# Altium schematic sheet Microcontroller.SchDoc
size A3; ApprovedBy: OLD SCHOOL; CheckedBy: UDEMY; Revision: AA; SheetNumber: 4; SheetTotal: 5; Department: R&D Hardware; Size: A3; RreparedBy: M.Mesih ÇELİK; ReleaseDate: 06.10.2021; ChangedDate: 12.10.2021; BoardDescription: Wireless Security Detector
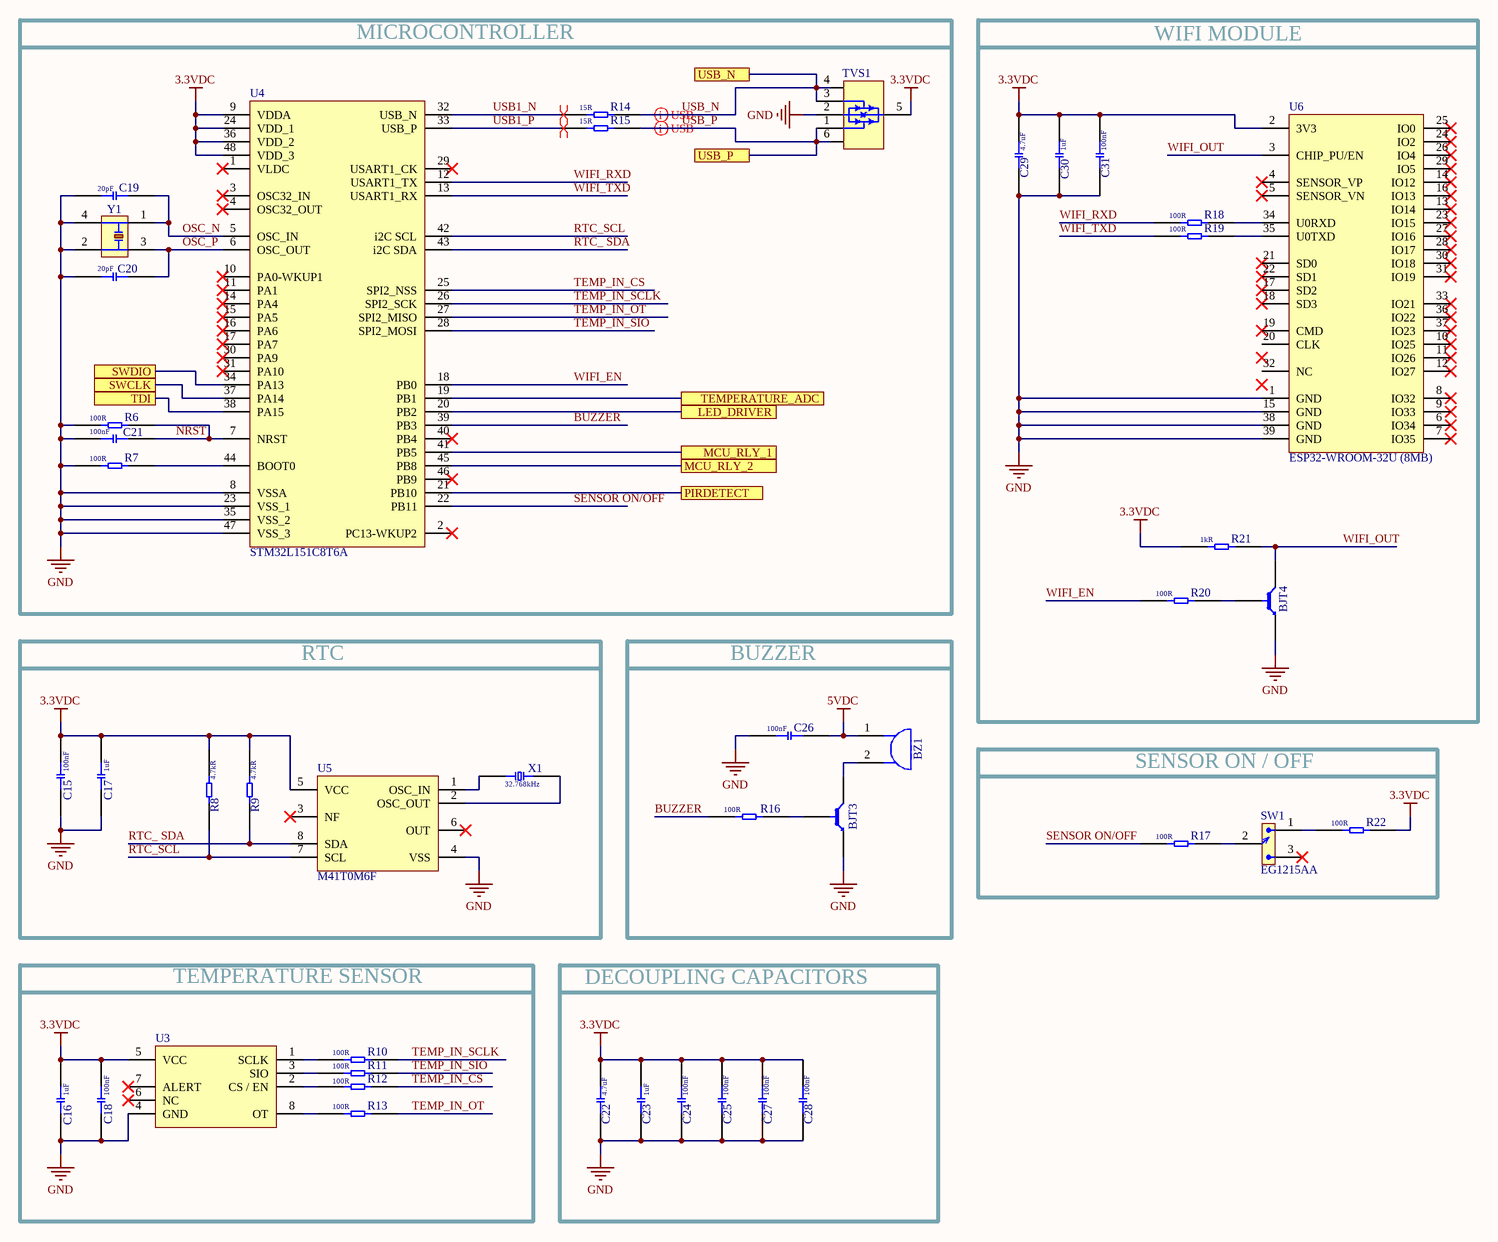
[diagram p0: Microcontroller.SchDoc]

## Parts
BJT3  MMBT3904-7-F  [SOT-23F]  (value not drawn)
BJT4  MMBT3904-7-F  [SOT-23F]  (value not drawn)
BZ1  CMI-1295IC-0585T  [CMI-1295IC]  (value not drawn)
C15  Capacitance: 100nF  [CAP_0603]  (hidden comment: C0603C104K5RACTU)
C16  Capacitance: 1uF  [CAP_0805]  (hidden comment: CL21B105KBFNNNE)
C17  Capacitance: 1uF  [CAP_0805]  (hidden comment: CL21B105KBFNNNE)
C18  Capacitance: 100nF  [CAP_0805]  (hidden comment: CL21B104KBCNNNC)
C19  Capacitance: 20pF  [CAP_0603]  (hidden comment: CL10C200JB8NNNC)
C20  Capacitance: 20pF  [CAP_0603]  (hidden comment: CL10C200JB8NNNC)
C21  Capacitance: 100nF  [CAP_0805]  (hidden comment: CL21B104KBCNNNC)
C22  Capacitance: 4.7uF  [CAP_0805]  (hidden comment: CL21A475KAQNNNE)
C23  Capacitance: 1uF  [CAP_0805]  (hidden comment: CL21B105KBFNNNE)
C24  Capacitance: 100nF  [CAP_0805]  (hidden comment: CL21B104KBCNNNC)
C25  Capacitance: 100nF  [CAP_0805]  (hidden comment: CL21B104KBCNNNC)
C26  Capaticante: 100nF  [CAP_0603]  (hidden comment: ALA7DF471CF450)
C27  Capacitance: 100nF  [CAP_0805]  (hidden comment: CL21B104KBCNNNC)
C28  Capacitance: 100nF  [CAP_0805]  (hidden comment: CL21B104KBCNNNC)
C29  Capacitance: 4.7uF  [CAP_0805]  (hidden comment: CL21A475KAQNNNE)
C30  Capacitance: 1uF  [CAP_0805]  (hidden comment: CL21B105KBFNNNE)
C31  Capacitance: 100nF  [CAP_0805]  (hidden comment: CL21B104KBCNNNC)
R6  Resistance: 100R  [RES_0603]  (hidden comment: RC0603JR-07100RL)
R7  Resistance: 100R  [RES_0603]  (hidden comment: RC0603JR-07100RL)
R8  Resistance: 4.7kR  [RES_0603]  (hidden comment: RC0603JR-074K7L)
R9  Resistance: 4.7kR  [RES_0603]  (hidden comment: RC0603JR-074K7L)
R10  Resistance: 100R  [RES_0603]  (hidden comment: RC0603JR-07100RL)
R11  Resistance: 100R  [RES_0603]  (hidden comment: RC0603JR-07100RL)
R12  Resistance: 100R  [RES_0603]  (hidden comment: RC0603JR-07100RL)
R13  Resistance: 100R  [RES_0603]  (hidden comment: RC0603JR-07100RL)
R14  Resistance: 15R  [RES_0603]  (hidden comment: RC0603JR-0715RL)
R15  Resistance: 15R  [RES_0603]  (hidden comment: RC0603JR-0715RL)
R16  Resistance: 100R  [RES_0603]  (hidden comment: RC0603JR-07100RL)
R17  Resistance: 100R  [RES_0603]  (hidden comment: RC0603JR-07100RL)
R18  Resistance: 100R  [RES_0603]  (hidden comment: RC0603JR-07100RL)
R19  Resistance: 100R  [RES_0603]  (hidden comment: RC0603JR-07100RL)
R20  Resistance: 100R  [RES_0603]  (hidden comment: RC0603JR-07100RL)
R21  Resistance: 1kR  [RES_0603]  (hidden comment: RC0603FR-101KL)
R22  Resistance: 100R  [RES_0603]  (hidden comment: RC0603JR-07100RL)
SW1  EG1215AA  [EG1215AA]
TVS1  USBLC6-2SC6  [SOT23-6L]  (value not drawn)
U3  MAX6662MSA+T  [SOIC8]  (value not drawn)
U4  STM32L151C8T6A  [LQFP48]
U5  M41T0M6F  [SOIC8]
U6  ESP32-WROOM-32U (8MB)  [ESP32_32U]
X1  Frequency: 32.768kHz  [ABS05]  (hidden comment: ABS05-32.768KHZ-T)
Y1  ECS-160-20-30B-TR  [SMD5032]  (value not drawn)

## Blocks framed on the sheet
MICROCONTROLLER: C19-C21 R6 R7 R14 R15 TVS1 U4 Y1
WIFI MODULE: BJT4 C29-C31 R18-R21 U6
RTC: C15 C17 R8 R9 U5 X1
BUZZER: BJT3 BZ1 C26 R16
SENSOR ON / OFF: R17 R22 SW1
TEMPERATURE SENSOR: C16 C18 R10-R13 U3
DECOUPLING CAPACITORS: C22-C25 C27 C28

## Ports
LED_DRIVER (see Power Management[4C]), MCU_RLY_1 (see Power Management[1D]), MCU_RLY_2 (see Power Management[2D]), PIRDETECT (see Power Management[4C]), SWCLK (see Power Management[4B]), SWDIO (see Power Management[4B]), TDI (see Power Management[4B]), TEMPERATURE_ADC (see Power Management[4C]), USB_N (see Power Management[3B]), USB_P (see Power Management[3B])

## Nets
3.3VDC: C15.2 C16.2 C17.2 C18.2 C22.2 C23.2 C24.2 C25.2 C27.2 C28.2 C29.2 C30.2 C31.2 R8.2 R9.2 R21.1 R22.2 TVS1.5(VBUS) U3.5(VCC) U4.9(VDDA) U4.24(VDD_1) U4.36(VDD_2) U4.48(VDD_3) U5.5(VCC) U6.2(3V3)
5VDC: BZ1.1 C26.2
GND: BJT3.2(E) BJT4.2(E) C15.1 C16.1 C17.1 C18.1 C19.1 C20.1 C21.2 C22.1 C23.1 C24.1 C25.1 C26.1 C27.1 C28.1 C29.1 C30.1 C31.1 R6.1 R7.1 TVS1.2(GND) U3.4(GND) U4.8(VSSA) U4.23(VSS_1) U4.35(VSS_2) U4.47(VSS_3) U5.4(VSS) U6.1(GND) U6.15(GND) U6.38(GND) U6.39(GND) Y1.2(GND) Y1.4(GND)
BUZZER: R16.1 U4.39(PB3)
LED_DRIVER: U4.20(PB2) ; port LED_DRIVER
MCU_RLY_1: U4.41(PB5) ; port MCU_RLY_1
MCU_RLY_2: U4.45(PB8) ; port MCU_RLY_2
NRST: C21.1 R6.2 U4.7(NRST)
OSC_N: C19.2 U4.5(OSC_IN) Y1.1(IN/OUT)
OSC_P: C20.2 U4.6(OSC_OUT) Y1.3(OUT/IN)
PIRDETECT: U4.21(PB10) ; port PIRDETECT
RTC_ SDA: R9.1 U4.43(i2C_SDA) U5.8(SDA)
RTC_SCL: R8.1 U4.42(i2C_SCL) U5.7(SCL)
SENSOR ON/OFF: R17.1 U4.22(PB11)
SWCLK: U4.37(PA14) ; port SWCLK
SWDIO: U4.34(PA13) ; port SWDIO
TDI: U4.38(PA15) ; port TDI
TEMP_IN_CS: R12.1 U4.25(SPI2_NSS)
TEMP_IN_OT: R13.1 U4.27(SPI2_MISO)
TEMP_IN_SCLK: R10.1 U4.26(SPI2_SCK)
TEMP_IN_SIO: R11.1 U4.28(SPI2_MOSI)
TEMPERATURE_ADC: U4.19(PB1) ; port TEMPERATURE_ADC
USB1_N: R14.1 U4.32(USB_N)
USB1_P: R15.1 U4.33(USB_P)
USB_N: R14.2 TVS1.3(D+in) TVS1.4(D+out) ; port USB_N
USB_P: R15.2 TVS1.1(D+in) TVS1.6(D-out) ; port USB_P
WIFI_EN: R20.1 U4.18(PB0)
WIFI_OUT: BJT4.3(C) R21.2 U6.3(CHIP_PU/EN)
WIFI_RXD: R18.2 U4.12(USART1_TX)
WIFI_TXD: R19.2 U4.13(USART1_RX)
NetBJT3_1: BJT3.1(B) R16.2
NetBJT3_3: BJT3.3(C) BZ1.2
NetBJT4_1: BJT4.1(B) R20.2
NetR7_2: R7.2 U4.44(BOOT0)
NetR10_2: R10.2 U3.1(SCLK)
NetR11_2: R11.2 U3.3(SIO)
NetR12_2: R12.2 U3.2(CS_/_EN)
NetR13_2: R13.2 U3.8(OT)
NetR17_2: R17.2 SW1.2(Base)
NetR18_1: R18.1 U6.34(U0RXD)
NetR19_1: R19.1 U6.35(U0TXD)
NetR22_1: R22.1 SW1.1
NetU5_1: U5.1(OSC_IN) X1.1
NetU5_2: U5.2(OSC_OUT) X1.2

Not connected (* = marked no-connect by the designer): SW1 3*; U3 6(NC)* 7(ALERT)*; U4 1(VLDC)* 2(PC13-WKUP2)* 3(OSC32_IN)* 4(OSC32_OUT)* 10(PA0-WKUP1)* 11(PA1)* 14(PA4)* 15(PA5)* 16(PA6)* 17(PA7)* 29(USART1_CK)* 30(PA9)* 31(PA10)* 40(PB4)* 46(PB9)*; U5 3(NF)* 6(OUT)*; U6 4(SENSOR_VP)* 5(SENSOR_VN)* 6(IO34)* 7(IO35)* 8(IO32)* 9(IO33)* 10(IO25)* 11(IO26)* 12(IO27)* 13(IO14)* 14(IO12)* 16(IO13)* 17(SD2)* 18(SD3)* 19(CMD)* 20(CLK) 21(SD0)* 22(SD1)* 23(IO15)* 24(IO2)* 25(IO0)* 26(IO4)* 27(IO16)* 28(IO17)* 29(IO5)* 30(IO18)* 31(IO19)* 32(NC) 33(IO21)* 36(IO22)* 37(IO23)*

## Layout directives
differential pair: USB1_N, USB1_P, USB_N, USB_P

## Notes on the sheet
- DOSYA ADI / FILE NAME
- TANIM / DESCRIPTION
- HAZIRLAYAN / PREPARED BY
- YAYIN TARİHİ / REL. DATE
- ONAYLAYAN / APPROVED BY
- KONTROL EDEN / CHECKED BY
- BÖLÜM / DEPARTMENT
- BOYUT / SIZE
- DEĞ. TARİHİ / CHANGE DATE
- REVİZYON / REVISION
- SAYFA / SHEET
- /

## Library data of the parts
BJT3 BJT4 = MMBT3904-7-F: TRANS NPN 40V 0.2A SMD SOT23-3; Manufacturer: Diodes Zetex; Designed by: M.C; Max Power Dissipation: 300mW; Max Collector Current: 200mA; Collector Base Voltage (VCBO): 60V; Frequency: 300MHz; hFE Min: 100; Number of Elements: 1; Emitter Base Voltage (VEBO): 6V; Collector Emitter Saturation Voltage: 300mV; Power Dissipation: 350mW; Element Configuration: Single; Supplier 1: Digi-Key; Manufacturer Part Number: MMBT3904-7-F; RoHS: Yes; Category: BJTs; Pricing 1: 3000=0,02271, 6000=0,02048, 15000=0,01781, 30000=0,01603, 75000=0,01425 (USD); Mount: Surface Mount; Case/Package: SOT-23; Number of Pins: 3; Weight: 0.000282oz; Contact Plating: Tin,Matte; Min Operating Temperature: -55°C; Max Operating Temperature: 150°C; Collector Emitter Voltage (VCEO): 40V; Polarity: NPN; Packaging: Tape and Reel; Package Quantity: 3000; Transition Frequency: 300MHz; Collector Emitter Breakdown Voltage: 40V; Max Breakdown Voltage: 40V; Continuous Collector Current: 200mA; Max Frequency: 300MHz; Gain Bandwidth Product: 300MHz; Series: -; Collector-emitter Voltage-Max: 300mV; Voltage Rating (DC): 40V; Length: 3.05mm; Width: 1.4mm; Height: 1mm; Radiation Hardening: No; REACH SVHC: No SVHC; Lead Free: Lead Free; RoHS Compliant: Yes; ComponentLink1URL: https://datasheet.ciiva.com/11201/ds30036-11201778.pdf?src-supplier=Avnet; ComponentLink1Description: https://datasheet.ciiva.com/11201/ds30036-11201778.pdf?src-supplier=Avnet; ComponentLink2URL: https://datasheet.ciiva.com/15138/getdatasheetpartid-53265-15138780.pdf?src-supplier=Verical; ComponentLink2Description: https://datasheet.ciiva.com/15138/getdatasheetpartid-53265-15138780.pdf?src-supplier=Verical; ComponentLink3URL: https://datasheet.ciiva.com/22711/1915516-22711750.pdf?src-supplier=Element14; ComponentLink3Description: https://datasheet.ciiva.com/22711/1915516-22711750.pdf?src-supplier=Element14; ComponentLink4URL: https://datasheet.ciiva.com/11198/ds30036-11198999.pdf?src-supplier=Avnet; ComponentLink4Description: https://datasheet.ciiva.com/11198/ds30036-11198999.pdf?src-supplier=Avnet; ComponentLink5URL: https://datasheet.ciiva.com/6361/ds30036-6361256.pdf?src-supplier=Digi-Key; ComponentLink5Description: https://datasheet.ciiva.com/6361/ds30036-6361256.pdf?src-supplier=Digi-Key; ComponentLink6URL: https://datasheet.ciiva.com/6361/ds30036-6361254.pdf?src-supplier=Digi-Key; ComponentLink6Description: https://datasheet.ciiva.com/6361/ds30036-6361254.pdf?src-supplier=Digi-Key; Supplier Part Number 1: MMBT3904-FDITR-ND
BZ1 = CMI-1295IC-0585T: Buzzers Indicator, Internally Driven Magnetic 5 V 30mA 2.4kHz 85dB @ 5V, 10cm Through Hole PC Pins; Manufacturer: CUI Devices; Designed by: M.C; Supplier 1: Arrow Electronics; Manufacturer Part Number: CMI-1295IC-0585T; RoHS: No; Category: Audio Products; Stock 1: 560; Pricing 1: 1=0,83580, 10=0,81870, 25=0,79320, 50=0,76310, 100=0,73260, 300=0,69860, 1=1,04980, 10=1,00960, 25=0,95200, 50=0,88810, 100=0,82700, 300=0,70560, 1000=0,65420, 5000=0,64090 (USD); Supplier Part Number 1: CMI-1295IC-0585T; Case/Package: CMI-1295IC; Supplier 2: Digi-Key; Stock 2: 688; Pricing 2: 1=1,05000, 10=1,00900, 25=0,96960, 50=0,91260, 100=0,85770, 500=0,73794, 1000=0,69160 (USD); Supplier Part Number 2: 2223-CMI-1295IC-0585T-ND
C15 = CAP 100nF 0603: Multilayer Ceramic Capacitors (MLCC) - SMD/SMT 50volts 0.1uF X7R 10%; Manufacturer: KEMET; Designed by: M.C; Voltage Rating (DC): 50V; Dissipation Factor: 2.5%; Supplier 1: Digi-Key; Manufacturer Part Number: C0603C104K5RACTU; RoHS: Yes; Category: Ceramic Capacitors; Stock 1: 6388973; Pricing 1: 4000=0,01852 (USD); Mount: Surface Mount; Case/Package: 0603; Number of Pins: 2; Case Code (Metric): 1608; Case Code (Imperial): 0603; Dielectric Material: Ceramic; Contact Plating: Tin,Matte; Min Operating Temperature: -55°C; Max Operating Temperature: 125°C; Tolerance: 10%; Packaging: Tape and Reel; Package Quantity: 1; Dielectric: X7R; Termination: SMD/SMT; Voltage: 50V; Voltage Rating: 50V; Series: SMD Comm X7R; Length: 0.063inch; Width: 0.031inch; Height: 0.8mm; Thickness: 0.034inch; Lead Pitch: 0.7mm; Depth: 0.8mm; Radiation Hardening: No; RoHS Compliant: Yes; REACH SVHC: No SVHC; ComponentLink1URL: https://datasheet.ciiva.com/7823/kem-c1002-x7r-smd-7823591.pdf?src-supplier=Element14; ComponentLink1Description: https://datasheet.ciiva.com/7823/kem-c1002-x7r-smd-7823591.pdf?src-supplier=Element14; ComponentLink2URL: https://datasheet.ciiva.com/7823/kem-c1002-x7r-smd-7823592.pdf?src-supplier=Element14; ComponentLink2Description: https://datasheet.ciiva.com/7823/kem-c1002-x7r-smd-7823592.pdf?src-supplier=Element14; ComponentLink3URL: https://datasheet.ciiva.com/5999/kem-c1002-x7r-smd-5999400.pdf?src-supplier=Farnell; ComponentLink3Description: https://datasheet.ciiva.com/5999/kem-c1002-x7r-smd-5999400.pdf?src-supplier=Farnell; ComponentLink4URL: https://datasheet.ciiva.com/28645/1851736-28645640.pdf?src-supplier=Element14; ComponentLink4Description: https://datasheet.ciiva.com/28645/1851736-28645640.pdf?src-supplier=Element14; ComponentLink5URL: https://datasheet.ciiva.com/14585/70095383-14585209.pdf?src-supplier=Allied+Electronics; ComponentLink5Description: https://datasheet.ciiva.com/14585/70095383-14585209.pdf?src-supplier=Allied+Electronics; ComponentLink6URL: https://datasheet.ciiva.com/14602/70095383-14602583.pdf?src-supplier=Allied+Electronics; ComponentLink6Description: https://datasheet.ciiva.com/14602/70095383-14602583.pdf?src-supplier=Allied+Electronics; Supplier 2: RSComponents; Stock 2: 55000; Pricing 2: 1000=0,03000 (GBP); Supplier Part Number 2: 8015347; Supplier Part Number 1: 399-C0603C104K5RAC7867TR-ND
C16 C17 C23 C30 = CAP 1uF 0805: SAMSUNG ELECTRO-MECHANICS - CL21B105KBFNNNE - SMD Multilayer Ceramic Capacitor, 1 µF, 50 V, 0805 [2012 Metric], ± 10%, X7R, CL Series; Designed by: M.C; Voltage Rating: 50V; Supplier 1: Digi-Key; Manufacturer: Samsung; Manufacturer Part Number: CL21B105KBFNNNE; RoHS: Yes; Category: Ceramic Capacitors; Pricing 1: 2000=0,02295 (USD); Mount: Surface Mount; Case/Package: 0805; Case Code (Metric): 2012; Case Code (Imperial): 0805; Min Operating Temperature: -55°C; Max Operating Temperature: 125°C; Tolerance: 10%; Packaging: Tape and Reel; Package Quantity: 1; Dielectric: X7R; Voltage: 50V; Series: CL; Construction: Flat; Length: 2mm; Width: 0.049inch; Height: 1.25mm; Thickness: 0.053inch; Depth: 1.25mm; Radiation Hardening: No; RoHS Compliant: Yes; ComponentLink1URL: https://datasheet.ciiva.com/25800/cl21b105kbfnnne-25800291.pdf?src-supplier=Digi-Key; ComponentLink1Description: https://datasheet.ciiva.com/25800/cl21b105kbfnnne-25800291.pdf?src-supplier=Digi-Key; ComponentLink2URL: https://datasheet.ciiva.com/16449/cl21b105kbfnnne-16449003.pdf?src-supplier=Future+Electronics; ComponentLink2Description: https://datasheet.ciiva.com/16449/cl21b105kbfnnne-16449003.pdf?src-supplier=Future+Electronics; ComponentLink3URL: https://datasheet.ciiva.com/26838/getdatasheetpartid-354075-26838668.pdf?src-supplier=Verical; ComponentLink3Description: https://datasheet.ciiva.com/26838/getdatasheetpartid-354075-26838668.pdf?src-supplier=Verical; Supplier Part Number 1: 1276-1029-2-ND
C18 C21 C24 C25 C27 C28 C31 = CAP 100nF 0805: Samsung Electro-Mechanics 100nF Multilayer Ceramic Capacitor (MLCC) 50 V 10% X7R dielectric CL max op. temp. +125C; Designed by: M.C; Voltage Rating: 50V; Supplier 1: Digi-Key; Manufacturer: Samsung; Manufacturer Part Number: CL21B104KBCNNNC; RoHS: Yes; Category: Ceramic Capacitors; Pricing 1: 4000=0,01050 (USD); Mount: Surface Mount; Case/Package: 0805; Case Code (Metric): 2012; Case Code (Imperial): 0805; Material: Ceramic; Contact Plating: Tin; Min Operating Temperature: -55°C; Max Operating Temperature: 125°C; Tolerance: 10%; Dielectric: X7R; Packaging: Tape and Reel; Voltage: 50V; Voltage Rating (DC): 50V; Series: CL; Construction: Flat; Length: 2mm; Width: 0.049inch; Height: 0.85mm; Depth: 1.25mm; Thickness: 0.037inch; Radiation Hardening: No; Lead Free: Lead Free; RoHS Compliant: Yes; ComponentLink1URL: https://datasheet.ciiva.com/25710/cl21b104kbcnnnc-25710182.pdf?src-supplier=Digi-Key; ComponentLink1Description: https://datasheet.ciiva.com/25710/cl21b104kbcnnnc-25710182.pdf?src-supplier=Digi-Key; ComponentLink2URL: https://datasheet.ciiva.com/29199/454152-da-01-en-vs-kondensator-0805-29199814.pdf?src-supplier=Conrad; ComponentLink2Description: https://datasheet.ciiva.com/29199/454152-da-01-en-vs-kondensator-0805-29199814.pdf?src-supplier=Conrad; Supplier 2: Mouser; Stock 2: 787824; Pricing 2: 1=0,11000, 10=0,03300, 50=0,03300, 100=0,02400, 500=0,01700, 1000=0,01300, 2000=0,01200, 4000=0,01100, 8000=0,00900, 10000=0,00900 (USD); Supplier Part Number 1: 1276-1003-2-ND; Supplier Part Number 2: 187-CL21B104KBCNNNC
C19 C20 = CAP 20pF 0805: SAMSUNG ELECTRO-MECHANICS - CL10C200JB8NNNC - SMD Multilayer Ceramic Capacitor, 20 pF, 50 V, 0603 [1608 Metric], ± 5%, C0G / NP0, CL Series; Designed by: M.C; Voltage Rating: 50V; Temperature Coefficient: 300ppm/°C; Supplier 1: Digi-Key; Manufacturer: Samsung; Manufacturer Part Number: CL10C200JB8NNNC; RoHS: Yes; Category: Ceramic Capacitors; Stock 1: 299735; Pricing 1: 4000=0,01024 (USD); Mount: Surface Mount; Case/Package: 0603; Case Code (Metric): 1608; Case Code (Imperial): 0603; Min Operating Temperature: -55°C; Max Operating Temperature: 125°C; Tolerance: 5%; Dielectric: C0G; Package Quantity: 1; Packaging: Tape and Reel; Voltage: 50V; Series: CL; Construction: Flat; Length: 1.6mm; Width: 0.031inch; Height: 0.8mm; Thickness: 0.035inch; Depth: 0.8mm; Radiation Hardening: No; RoHS Compliant: Yes; ComponentLink1URL: https://datasheet.ciiva.com/26877/getdatasheetpartid-640634-26877974.pdf?src-supplier=Verical; ComponentLink1Description: https://datasheet.ciiva.com/26877/getdatasheetpartid-640634-26877974.pdf?src-supplier=Verical; ComponentLink2URL: https://datasheet.ciiva.com/26310/mlcc-catalogdownload2013-eng-26310315.pdf?src-supplier=Distrelec; ComponentLink2Description: https://datasheet.ciiva.com/26310/mlcc-catalogdownload2013-eng-26310315.pdf?src-supplier=Distrelec; Supplier Part Number 1: 1276-1187-2-ND
C22 C29 = CAP 4.7uF 0805: SAMSUNG ELECTRO-MECHANICS - CL21A475KAQNNNE - SMD Multilayer Ceramic Capacitor, 4.7 µF, 25 V, 0805 [2012 Metric], ± 10%, X5R, CL Series; Designed by: M.C; Voltage Rating: 25V; Supplier 1: Digi-Key; Manufacturer: Samsung; Manufacturer Part Number: CL21A475KAQNNNE; RoHS: Yes; Category: Ceramic Capacitors; Pricing 1: 2000=0,02103 (USD); Mount: Surface Mount; Case/Package: 0805; Case Code (Metric): 2012; Case Code (Imperial): 0805; Min Operating Temperature: -55°C; Max Operating Temperature: 85°C; Package Quantity: 1; Packaging: Tape and Reel; Tolerance: 10%; Dielectric: X5R; Voltage Rating (DC): 25V; Series: CL; Construction: Flat; Length: 2mm; Width: 0.049inch; Height: 1.25mm; Thickness: 0.055inch; Depth: 1.25mm; Radiation Hardening: No; Lead Free: Lead Free; RoHS Compliant: Yes; ComponentLink1URL: https://datasheet.ciiva.com/25798/cl21a475kaqnnne-25798882.pdf?src-supplier=Digi-Key; ComponentLink1Description: https://datasheet.ciiva.com/25798/cl21a475kaqnnne-25798882.pdf?src-supplier=Digi-Key; Supplier 2: Mouser; Stock 2: 6240; Pricing 2: 1=0,12000, 10=0,05700, 50=0,05700, 100=0,04100, 500=0,03000, 1000=0,02500, 2000=0,02300, 4000=0,01800, 10000=0,01600 (USD); Supplier Part Number 1: 1276-1244-2-ND; Supplier Part Number 2: 187-CL21A475KAQNNNE
C26 = CAP 100nf 0603_1: CAP CER 100nF %10 0603 SMD; Manufacturer: KEMET; Designed by: M.C; Supplier 1: Digi-Key; Manufacturer Part Number: ALA7DF471CF450; RoHS: No; Pricing 1: 1120=5,49651 (USD); Supplier Part Number 1: ALA7DF471CF450-ND; Case/Package: 0603
R6 R7 R10-R13 R16-R20 R22 = RES 100R OHM 0603: Res Thick Film 0603 100 Ohm 5% 0.1W(1/10W) ±100ppm/C Molded SMD Paper T/R; Manufacturer: Yageo; Designed by: M.C; Temperature Coefficient: 100ppm/°C; Voltage Rating (DC): 50V; Power Rating: 100mW; Supplier 1: Digi-Key; Manufacturer Part Number: RC0603JR-07100RL; RoHS: Yes; Category: Chip SMD Resistors; Stock 1: 387967; Pricing 1: 5000=0,00258 (USD); Case/Package: 0603; Number of Pins: 2; Contact Plating: Tin,Matte; Case Code (Imperial): 0603; Case Code (Metric): 1608; Size Code: 0603; Min Operating Temperature: -55°C; Max Operating Temperature: 155°C; Tolerance: 5%; Resistor Type: Thick Film; Packaging: Tape and Reel; Voltage Rating: 50V; Termination: SMD/SMT; Features: Moisture Resistant; Series: RC; Max Power Dissipation: 100mW; Number of Terminations: 2; Construction: Rectangular; Resistance Tolerance: 5%; Length: 1.6mm; Width: 0.8mm; Depth: 0.8mm; Radiation Hardening: No; REACH SVHC: Unknown; Lead Free: Lead Free; Military Standard: Not; RoHS Compliant: Yes; ComponentLink1URL: https://datasheet.ciiva.com/7746/443971-7746425.pdf?src-supplier=Element14; ComponentLink1Description: https://datasheet.ciiva.com/7746/443971-7746425.pdf?src-supplier=Element14; ComponentLink2URL: https://datasheet.ciiva.com/7746/443971-7746426.pdf?src-supplier=Element14; ComponentLink2Description: https://datasheet.ciiva.com/7746/443971-7746426.pdf?src-supplier=Element14; ComponentLink3URL: https://datasheet.ciiva.com/8883/pyu-rc0603-51-rohs-l-4-8883047.pdf?src-supplier=Avnet; ComponentLink3Description: https://datasheet.ciiva.com/8883/pyu-rc0603-51-rohs-l-4-8883047.pdf?src-supplier=Avnet; ComponentLink4URL: https://datasheet.ciiva.com/15189/getdatasheetpartid-325207-15189846.pdf?src-supplier=Verical; ComponentLink4Description: https://datasheet.ciiva.com/15189/getdatasheetpartid-325207-15189846.pdf?src-supplier=Verical; Supplier Part Number 1: 311-100GRTR-ND
R8 R9 = RES 4.7kR OHM 0603: Res Thick Film 0603 4.7K Ohm 5% 0.1W(1/10W) ±100ppm/C Molded SMD Paper T/R; Manufacturer: Yageo; Designed by: M.C; Temperature Coefficient: 100ppm/°C; Voltage Rating (DC): 50V; Power Rating: 100mW; Supplier 1: Digi-Key; Manufacturer Part Number: RC0603JR-074K7L; RoHS: Yes; Category: Chip SMD Resistors; Stock 1: 519085; Pricing 1: 5000=0,00258 (USD); Case/Package: 0603; Number of Pins: 2; Case Code (Imperial): 0603; Case Code (Metric): 1608; Size Code: 0603; Min Operating Temperature: -55°C; Max Operating Temperature: 155°C; Resistor Type: Thick Film; Tolerance: 5%; Packaging: Tape and Reel; Voltage Rating: 50V; Termination: SMD/SMT; Features: Moisture Resistant; Max Power Dissipation: 100mW; Number of Terminations: 2; Series: RC; Resistance Tolerance: 5%; Construction: Rectangular; Length: 1.6mm; Width: 0.8mm; Depth: 0.8mm; REACH SVHC: No SVHC; Lead Free: Lead Free; RoHS Compliant: Yes; Military Standard: Not; ComponentLink1URL: https://datasheet.ciiva.com/46412/443971-46412858.pdf?src-supplier=Element14; ComponentLink1Description: https://datasheet.ciiva.com/46412/443971-46412858.pdf?src-supplier=Element14; Supplier Part Number 1: 311-4.7KGRTR-ND
R14 R15 = RES 15R OHM 0603: YAGEO - RC0603JR-0715RL - SMD Chip Resistor, 0603 [1608 Metric], 15 ohm, RC Series, 75 V, Thick Film, 100 mW; Designed by: M.C; Tolerance: 5%; Temperature Coefficient: 100ppm/°C; Voltage Rating (DC): 50V; Power Rating: 100mW; Voltage Rating: 75V; Supplier 1: Digi-Key; Manufacturer: Yageo; Manufacturer Part Number: RC0603JR-0715RL; RoHS: Yes; Category: Chip SMD Resistors; Stock 1: 75000; Pricing 1: 5000=0,00258 (USD); Case/Package: 0603; Number of Pins: 2; Case Code (Imperial): 0603; Case Code (Metric): 1608; Weight: 7.1E-05oz; Min Operating Temperature: -55°C; Max Operating Temperature: 155°C; Resistor Type: Thick Film; Packaging: Tape and Reel; Package Quantity: 1; Termination: SMD/SMT; Number of Terminations: 2; Max Power Dissipation: 100mW; Working Voltage: 75V; Features: Moisture Resistant; Series: RC; Resistance Tolerance: 5%; Construction: Rectangular; Length: 1.6mm; Width: 0.8mm; Height: 0.022inch; Depth: 0.8mm; REACH SVHC: No SVHC; Lead Free: Lead Free; Military Standard: Not; RoHS Compliant: Yes; ComponentLink1URL: https://datasheet.ciiva.com/2453/pyu-r-int-thick-7-2453085.pdf?src-supplier=Digi-Key; ComponentLink1Description: https://datasheet.ciiva.com/2453/pyu-r-int-thick-7-2453085.pdf?src-supplier=Digi-Key; ComponentLink2URL: https://datasheet.ciiva.com/7746/443971-7746445.pdf?src-supplier=Element14; ComponentLink2Description: https://datasheet.ciiva.com/7746/443971-7746445.pdf?src-supplier=Element14; ComponentLink3URL: https://datasheet.ciiva.com/2453/pyu-r-int-thick-7-2453086.pdf?src-supplier=Digi-Key; ComponentLink3Description: https://datasheet.ciiva.com/2453/pyu-r-int-thick-7-2453086.pdf?src-supplier=Digi-Key; ComponentLink4URL: https://datasheet.ciiva.com/7746/443971-7746446.pdf?src-supplier=Element14; ComponentLink4Description: https://datasheet.ciiva.com/7746/443971-7746446.pdf?src-supplier=Element14; ComponentLink5URL: https://datasheet.ciiva.com/2453/pyu-r-int-thick-7-2453087.pdf?src-supplier=Digi-Key; ComponentLink5Description: https://datasheet.ciiva.com/2453/pyu-r-int-thick-7-2453087.pdf?src-supplier=Digi-Key; Supplier Part Number 1: 311-15GRTR-ND
R21 = RES 1kR OHM 0603: Res Thick Film 0603 1K Ohm 1% 0.1W(1/10W) ±100ppm/C Pad SMD T/R; Manufacturer: Yageo; Temperature Coefficient: 100ppm/°C; Power Rating: 100mW; Voltage Rating: 50V; Designed by: M.C; Supplier 1: Digi-Key; Manufacturer Part Number: RC0603FR-101KL; RoHS: Yes; Category: Chip SMD Resistors; Stock 1: 46; Pricing 1: 1=0,10000, 10=0,02400, 100=0,00970, 1000=0,00436, 2500=0,00378, 5000=0,00312 (USD); Case/Package: 0603; Number of Pins: 2; Contact Plating: Tin,Lead,Matte; Case Code (Imperial): 0603; Case Code (Metric): 1608; Min Operating Temperature: -55°C; Max Operating Temperature: 155°C; Tolerance: 1%; Resistor Type: Thick Film; Packaging: Tape and Reel; Termination: SMD/SMT; Voltage Rating (DC): 50V; Series: RC; Construction: Rectangular; Resistance Tolerance: 1%; Length: 1.6mm; Width: 0.8mm; Height: 0.45mm; Depth: 0.8mm; Radiation Hardening: No; REACH SVHC: Unknown; Military Standard: Not; RoHS Compliant: Yes; ComponentLink1URL: https://datasheet.ciiva.com/12560/rc0603-272842-12560633.pdf?src-supplier=Mouser; ComponentLink1Description: https://datasheet.ciiva.com/12560/rc0603-272842-12560633.pdf?src-supplier=Mouser; ComponentLink2URL: https://datasheet.ciiva.com/7983/443971-7983659.pdf?src-supplier=Element14; ComponentLink2Description: https://datasheet.ciiva.com/7983/443971-7983659.pdf?src-supplier=Element14; Supplier Part Number 1: 13-RC0603FR-101KLCT-ND
SW1 = EG1215AA: Slide Switch, SPDT, 0.025A, 24V, SMD; Manufacturer: E-Switch; Designed by: M.C; Mechanical Life: 10000Cycles; Switch Function: On-On; Current Rating: 25mA; Actuator Type: Standard; Switch Travel: 1.5mm; Operating Force: 150gf; Zener Voltage: 9.1V; Tolerance: 4.95%; Max Power Dissipation: 5W; Impedance: 2R; Actuator Length: 1.4mm; Supplier 1: Digi-Key; Manufacturer Part Number: EG1215AA; RoHS: Yes; Stock 1: 1511; Pricing 1: 1=0,99000, 10=0,95100, 25=0,88840, 100=0,77150, 250=0,70200, 500=0,65080, 1000=0,60327 (USD); Mount: Surface Mount,Through Hole; Case/Package: Axial; Min Operating Temperature: -20°C; Max Operating Temperature: 175°C; Throw Configuration: SPDT; Packaging: Cut Tape; Voltage Rating (DC): 24V; Termination: Gull Wing; Electrical Life: 10000Cycles; ComponentLink1URL: https://media.digikey.com/pdf/Data%20Sheets/E-Switch%20PDFs/EG1215_Series_Ds.pdf?src-supplier=Digi-Key; ComponentLink1Description: https://media.digikey.com/pdf/Data%20Sheets/E-Switch%20PDFs/EG1215_Series_Ds.pdf?src-supplier=Digi-Key; ComponentLink2URL: http://www.farnell.com/datasheets/2645007.pdf?src-supplier=Farnell; ComponentLink2Description: http://www.farnell.com/datasheets/2645007.pdf?src-supplier=Farnell; Supplier Part Number 1: EG5720CT-ND; Supplier 2: Digi-Key; Pricing 2: 2500=0,54843, 5000=0,51187, 12500=0,47531 (USD); Supplier Part Number 2: EG5720TR-ND
TVS1 = USBLC6-2SC6: TVS DIODE 5.25V 17V SOT23-6; Manufacturer: STMicroelectronics; Designed by: M.C; Direction: Unidirectional,Bidirectional; Capacitance: 3.5pF; Operating Supply Voltage: 1.1V; Number of Channels: 2; Breakdown Voltage: 6V; Power Line Protection: Yes; Test Current: 1mA; Max Reverse Leakage Current: 150nA; Peak Pulse Current: 5A; Element Configuration: Dual; Data Rate: 480Mbps; Number of Elements: 1; Working Voltage: 5V; Supplier 1: RSComponents; Manufacturer Part Number: USBLC6-2SC6; RoHS: Yes; Category: TVS Diodes; Stock 1: 1510; Pricing 1: 10=0,61100, 50=0,57400, 100=0,54400, 250=0,51300, 500=0,48800, 10=0,43800, 50=0,41200, 100=0,39000, 250=0,36800, 500=0,35000 (USD); Mount: Surface Mount; Case/Package: SOT-23; Number of Pins: 6; Contact Plating: Tin,Matte; Min Operating Temperature: -40°C; Max Operating Temperature: 125°C; Clamping Voltage: 17V; Packaging: Tape and Reel; Package Quantity: 3000; Termination: SMD/SMT; Number of Bidirectional Channels: 2; Reverse Standoff Voltage: 5.25V; Min Breakdown Voltage: 6V; ESD Protection: Yes; Leakage Current: 150nA; Series: USB; Reverse Breakdown Voltage: 6V; Polarity: Unidirectional,Bidirectional; Max Breakdown Voltage: 6V; Clamping Voltage-Max: 17V; Length: 3.05mm; Width: 1.75mm; Height: 1.3mm; Depth: 1.75mm; Radiation Hardening: No; REACH SVHC: No SVHC; Lead Free: Lead Free; RoHS Compliant: Yes; ComponentLink1URL: https://datasheet.ciiva.com/1268/1690354-1268384.pdf?src-supplier=Element14; ComponentLink1Description: https://datasheet.ciiva.com/1268/1690354-1268384.pdf?src-supplier=Element14; ComponentLink2URL: https://datasheet.ciiva.com/4508/cd00050750-113117-4508433.pdf?src-supplier=Mouser; ComponentLink2Description: https://datasheet.ciiva.com/4508/cd00050750-113117-4508433.pdf?src-supplier=Mouser; ComponentLink3URL: https://datasheet.ciiva.com/15143/getdatasheetpartid-148465-15143789.pdf?src-supplier=Verical; ComponentLink3Description: https://datasheet.ciiva.com/15143/getdatasheetpartid-148465-15143789.pdf?src-supplier=Verical; ComponentLink4URL: https://datasheet.ciiva.com/26787/usblc6-2sc6-26787908.pdf?src-supplier=IIIC; ComponentLink4Description: https://datasheet.ciiva.com/26787/usblc6-2sc6-26787908.pdf?src-supplier=IIIC; ComponentLink5URL: https://datasheet.ciiva.com/16200/cd00050750-16200026.pdf?src-supplier=Future+Electronics; ComponentLink5Description: https://datasheet.ciiva.com/16200/cd00050750-16200026.pdf?src-supplier=Future+Electronics; ComponentLink6URL: https://datasheet.ciiva.com/41444/001184109-da-01-en-ic-esd-protecti-usblc6-2sc6-sot-23-6-stm-41444156.pdf?src-supplier=Conrad; ComponentLink6Description: https://datasheet.ciiva.com/41444/001184109-da-01-en-ic-esd-protecti-usblc6-2sc6-sot-23-6-stm-41444156.pdf?src-supplier=Conrad; Supplier Part Number 1: 6247693
U3 = MAX6662MSA+T: Temp Sensor Digital Serial (3-Wire, SPI) 8-Pin SOIC N T/R; Manufacturer: Maxim; Designed by: M.C; Output Type: SPI,Digital; Operating Supply Voltage: 5.5V; Min Supply Voltage (DC): 3V; Resolution: 12b; Supplier 1: Digi-Key; Manufacturer Part Number: MAX6662MSA+T; RoHS: Yes; Category: Temperature and Humidity Sensors; Pricing 1: 2500=2,07746 (USD); Case/Package: SOIC; Number of Pins: 8; Min Operating Temperature: -55°C; Max Operating Temperature: 150°C; Interface: SPI; Packaging: Tape and Reel; Package Quantity: 2500; Max Supply Voltage (DC): 5.5V; Series: MAX6662; Radiation Hardening: No; RoHS Compliant: Yes; Lead Free: Lead Free; ComponentLink1URL: https://datasheet.ciiva.com/2004/max6662-2004572.pdf?src-supplier=Digi-Key; ComponentLink1Description: https://datasheet.ciiva.com/2004/max6662-2004572.pdf?src-supplier=Digi-Key; ComponentLink2URL: https://datasheet.ciiva.com/3279/max6662-3279710.pdf?src-supplier=Avnet; ComponentLink2Description: https://datasheet.ciiva.com/3279/max6662-3279710.pdf?src-supplier=Avnet; Supplier Part Number 1: MAX6662MSA+T-ND
U4 = STM32L151C8T6A: IC MCU 32BIT 64KB FLASH 48LQFP; Manufacturer: STMicroelectronics; Frequency: 32MHz; Interface: I2C,SPI,USB,IrDA,UART,USART,LIN; Number of I/Os: 37; Oscillator Type: Internal; RAM Size: 32KB; Min Supply Voltage: 1.8V; Max Supply Voltage: 3.6V; Peripherals: Brown-out Detect/Reset,POR,PWM,WDT,DMA; Data Bus Width: 32b; Number of Timers/Counters: 8; Watchdog Timer: Yes; Max Power Dissipation: 364mW; Core Architecture: ARM; Designed by: M.C; SleepMode: OK; RoHS: Yes; Category: Microcontrollers; Stock 1: 12; Pricing 1: 1=5,76000, 10=5,16900, 25=4,88720, 80=4,23538, 250=4,01820, 500=3,62000 (USD); Mount: Surface Mount; Case/Package: LQFP; Number of Pins: 48; Min Operating Temperature: -40°C; Max Operating Temperature: 85°C; Packaging: Tray; Memory Type: FLASH; Memory Size: 64KB; Max Frequency: 32MHz; Number of Programmable I/O: 37; RoHS Compliant: Yes; REACH SVHC: No SVHC; Lead Free: Lead Free; ComponentLink1URL: http://www.mouser.com/ds/2/389/DM00078689-524617.pdf?src-supplier=Mouser; ComponentLink1Description: http://www.mouser.com/ds/2/389/DM00078689-524617.pdf?src-supplier=Mouser; ComponentLink2URL: http://www.farnell.com/datasheets/2308904.pdf?src-supplier=Farnell; ComponentLink2Description: http://www.farnell.com/datasheets/2308904.pdf?src-supplier=Farnell; ComponentLink3URL: http://www.st.com/web/en/resource/technical/document/datasheet/DM00098321.pdf?src-supplier=Avnet; ComponentLink3Description: http://www.st.com/web/en/resource/technical/document/datasheet/DM00098321.pdf?src-supplier=Avnet; ComponentLink4URL: http://www.st.com/web/en/resource/technical/document/datasheet/DM00098321.pdf?src-supplier=Avnet+Asia; ComponentLink4Description: http://www.st.com/web/en/resource/technical/document/datasheet/DM00098321.pdf?src-supplier=Avnet+Asia; ComponentLink5URL: http://www.farnell.com/datasheets/1897875.pdf?src-supplier=Element14; ComponentLink5Description: http://www.farnell.com/datasheets/1897875.pdf?src-supplier=Element14; ComponentLink6URL: http://www.st.com/content/ccc/resource/technical/document/datasheet/81/27/7d/29/b7/bd/49/f0/DM00078689.pdf/files/DM00078689.pdf/jcr:content/translations/en.DM00078689.pdf?src-supplier=Digi-Key; ComponentLink6Description: http://www.st.com/content/ccc/resource/technical/document/datasheet/81/27/7d/29/b7/bd/49/f0/DM00078689.pdf/files/DM00078689.pdf/jcr:content/translations/en.DM00078689.pdf?src-supplier=Digi-Key; Supplier 1: Digi-Key; Supplier Part Number 1: 497-17514-ND; Manufacturer Part Number: STM32L151C8T6A; Supplier 2: Newark; Stock 2: 250; Pricing 2: 1=5,34000, 10=4,60000, 25=4,42000, 50=4,24000, 100=4,04000, 250=3,86000 (USD); Supplier Part Number 2: 42Y1064
U5 = M41T0M6F: Real Time Clock Serial 8Byte 8-Pin SO N T/R; Manufacturer: STMicroelectronics; Time Format: HH:MM:SS; Non-volatile Memory Size: 8B; Max Supply Voltage: 5.5V; Min Supply Voltage: 2V; Interface: I2C,Serial,2-Wire; Date Format: YY-MM-DD-dd; Designed by: M.C; Supplier 1: Digi-Key; RoHS: Yes; Category: Memory; Stock 1: 4018; Pricing 1: 1=2,15000, 10=1,93200, 25=1,82280, 100=1,55290, 250=1,45812, 500=1,27586, 1000=1,20365 (USD); Mount: Surface Mount; Case/Package: SOIC; Number of Pins: 8; Weight: 0.019048oz; Min Operating Temperature: -40°C; Max Operating Temperature: 85°C; Logic Function: Clock; Packaging: Tape and Reel; Package Quantity: 2500; Memory Size: 8B; Series: M41T0M; Supply Voltage-Nom: 5.5V; Length: 5mm; Width: 4mm; Height: 1.5mm; Radiation Hardening: No; Lead Free: Lead Free; Temperature Grade: INDUSTRIAL; RoHS Compliant: Yes; ComponentLink1URL: https://datasheet.ciiva.com/25969/cd00003139-25969712.pdf?src-supplier=Avnet+Europe; ComponentLink1Description: https://datasheet.ciiva.com/25969/cd00003139-25969712.pdf?src-supplier=Avnet+Europe; ComponentLink2URL: https://datasheet.ciiva.com/4772/cd00003139-81284-4772149.pdf?src-supplier=Mouser; ComponentLink2Description: https://datasheet.ciiva.com/4772/cd00003139-81284-4772149.pdf?src-supplier=Mouser; ComponentLink3URL: https://datasheet.ciiva.com/41459/001185346-da-01-en-ic-rtc-serial-2-5-5v-m41t0m6f-soic-8-stm-41459817.pdf?src-supplier=Conrad; ComponentLink3Description: https://datasheet.ciiva.com/41459/001185346-da-01-en-ic-rtc-serial-2-5-5v-m41t0m6f-soic-8-stm-41459817.pdf?src-supplier=Conrad; ComponentLink4URL: https://datasheet.ciiva.com/26795/m41t0m6f-26795471.pdf?src-supplier=IIIC; ComponentLink4Description: https://datasheet.ciiva.com/26795/m41t0m6f-26795471.pdf?src-supplier=IIIC; ComponentLink5URL: https://datasheet.ciiva.com/15152/getdatasheetpartid-98630-15152779.pdf?src-supplier=Verical; ComponentLink5Description: https://datasheet.ciiva.com/15152/getdatasheetpartid-98630-15152779.pdf?src-supplier=Verical; Supplier Part Number 1: 497-4698-1-ND; Manufacturer Part Number: M41T0M6F; Supplier 2: Digi-Key; Stock 2: 3312; Pricing 2: 2500=1,20365 (USD); Supplier Part Number 2: 497-4698-2-ND
U6 = ESP32-WROOM-32U (8MB): SMD Module, ESP32-D0WD, 64MBITS Spi Flash, Uart Mode, U.fl Antenna Connector; Manufacturer: Espressif Systems; Interface: I2C,SPI,GPIO,PWM,SDIO,UART; Frequency: 2.5GHz; Data Rate: 150Mbps; Sensitivity: -98dBm; Memory Size: 536KB; Resistance: 4.48kR; Tolerance: 0.1%; Max Power Dissipation: 125mW; Temperature Coefficient: 25ppm/°C; Designed by: M.C; Supplier 1: Digi-Key; RoHS: No; Category: RF Receivers, Transceivers; Stock 1: 142; Pricing 1: 1=4,35000 (USD); Mount: Surface Mount; Case/Package: SMD/SMT; Case Code (Imperial): 0805; Case Code (Metric): 2012; Min Operating Temperature: -40°C; Max Operating Temperature: 85°C; Resistor Type: Thin Film; Packaging: Cut Tape; Number of Terminations: 2; ComponentLink1URL: https://www.espressif.com/sites/default/files/documentation/esp32-wroom-32d_esp32-wroom-32u_datasheet_en.pdf?src-supplier=Digi-Key; ComponentLink1Description: https://www.espressif.com/sites/default/files/documentation/esp32-wroom-32d_esp32-wroom-32u_datasheet_en.pdf?src-supplier=Digi-Key; Supplier 2: Digi-Key; Pricing 2: 650=4,35000 (USD); Supplier Part Number 1: 1904-1027-1-ND; Supplier Part Number 2: 1904-1027-2-ND; Manufacturer Part Number: ESP32-WROOM-32U (8MB)
X1 = ABS05-32.768KHZ-T: ABRACON - ABS05-32.768KHZ-T - Crystal, 32.768 kHz, SMD, 1.6mm x 1mm, 12.5 pF, 20 ppm, ABS05 Series; Designed by: M.C; Frequency Tolerance: 20ppm; Load Capacitance: 12.5pF; ESR (Equivalent Series Resistance): 90kR; Supplier 1: Digi-Key; Manufacturer: Abracon; Manufacturer Part Number: ABS05-32.768KHZ-T; RoHS: Yes; Category: Crystals; Stock 1: 87000; Pricing 1: 3000=0,91392 (USD); Mount: Surface Mount; Case/Package: SMD/SMT; Number of Pins: 2; Min Operating Temperature: -40°C; Max Operating Temperature: 85°C; Packaging: Tape and Reel; Package Quantity: 3000; Tolerance: 20ppm; Termination: SMD/SMT; Series Resistance: 90kR; Series: ABS05; Operating Frequency: 32.768 kHz; Length: 1.6mm; Width: 0.039inch; Height: 0.02inch; Depth: 1mm; Radiation Hardening: No; REACH SVHC: No SVHC; Lead Free: Lead Free; RoHS Compliant: Yes; ComponentLink1URL: https://datasheet.ciiva.com/23810/abs05-23810480.pdf?src-supplier=Newark; ComponentLink1Description: https://datasheet.ciiva.com/23810/abs05-23810480.pdf?src-supplier=Newark; ComponentLink2URL: https://datasheet.ciiva.com/6728/abs05-6728949.pdf?src-supplier=Digi-Key; ComponentLink2Description: https://datasheet.ciiva.com/6728/abs05-6728949.pdf?src-supplier=Digi-Key; ComponentLink3URL: https://datasheet.ciiva.com/6728/abs05-6728950.pdf?src-supplier=Digi-Key; ComponentLink3Description: https://datasheet.ciiva.com/6728/abs05-6728950.pdf?src-supplier=Digi-Key; ComponentLink4URL: https://datasheet.ciiva.com/16411/abs05-16411149.pdf?src-supplier=Future+Electronics; ComponentLink4Description: https://datasheet.ciiva.com/16411/abs05-16411149.pdf?src-supplier=Future+Electronics; Supplier Part Number 1: 535-11899-2-ND
Y1 = ECS-160-20-30B-TR: CRYSTAL 16.0000MHZ 20PF SMD; Manufacturer: ECS International; Designed by: M.C; Frequency: 16MHz; Frequency Tolerance: 30ppm; ESR (Equivalent Series Resistance): 50R; Frequency Stability: 50ppm; Supplier 1: Digi-Key; Manufacturer Part Number: ECS-160-20-30B-TR; RoHS: Yes; Category: Crystals; Stock 1: 19000; Pricing 1: 1000=0,87025, 3000=0,82600, 5000=0,79650, 10000=0,78470 (USD); Mount: Surface Mount; Case/Package: SMD/SMT; Min Operating Temperature: -20°C; Max Operating Temperature: 70°C; Package Quantity: 1; Load Capacitance: 20pF; Packaging: Tape and Reel; Tolerance: 50ppm; Termination: SMD/SMT; Series: ECX-53B; Length: 0.197inch; Width: 0.126inch; Height: 0.033inch; Lead Free: Lead Free; RoHS Compliant: Yes; ComponentLink1URL: https://datasheet.ciiva.com/853/ecx-53b-853408.pdf?src-supplier=Digi-Key; ComponentLink1Description: https://datasheet.ciiva.com/853/ecx-53b-853408.pdf?src-supplier=Digi-Key; ComponentLink2URL: https://datasheet.ciiva.com/853/ecx-53b-853407.pdf?src-supplier=Digi-Key; ComponentLink2Description: https://datasheet.ciiva.com/853/ecx-53b-853407.pdf?src-supplier=Digi-Key; ComponentLink3URL: https://datasheet.ciiva.com/853/ecx-53b-853406.pdf?src-supplier=Digi-Key; ComponentLink3Description: https://datasheet.ciiva.com/853/ecx-53b-853406.pdf?src-supplier=Digi-Key; Supplier Part Number 1: XC1120TR-ND